# EAGLE design RoverGyro (EAGLE 6.4)
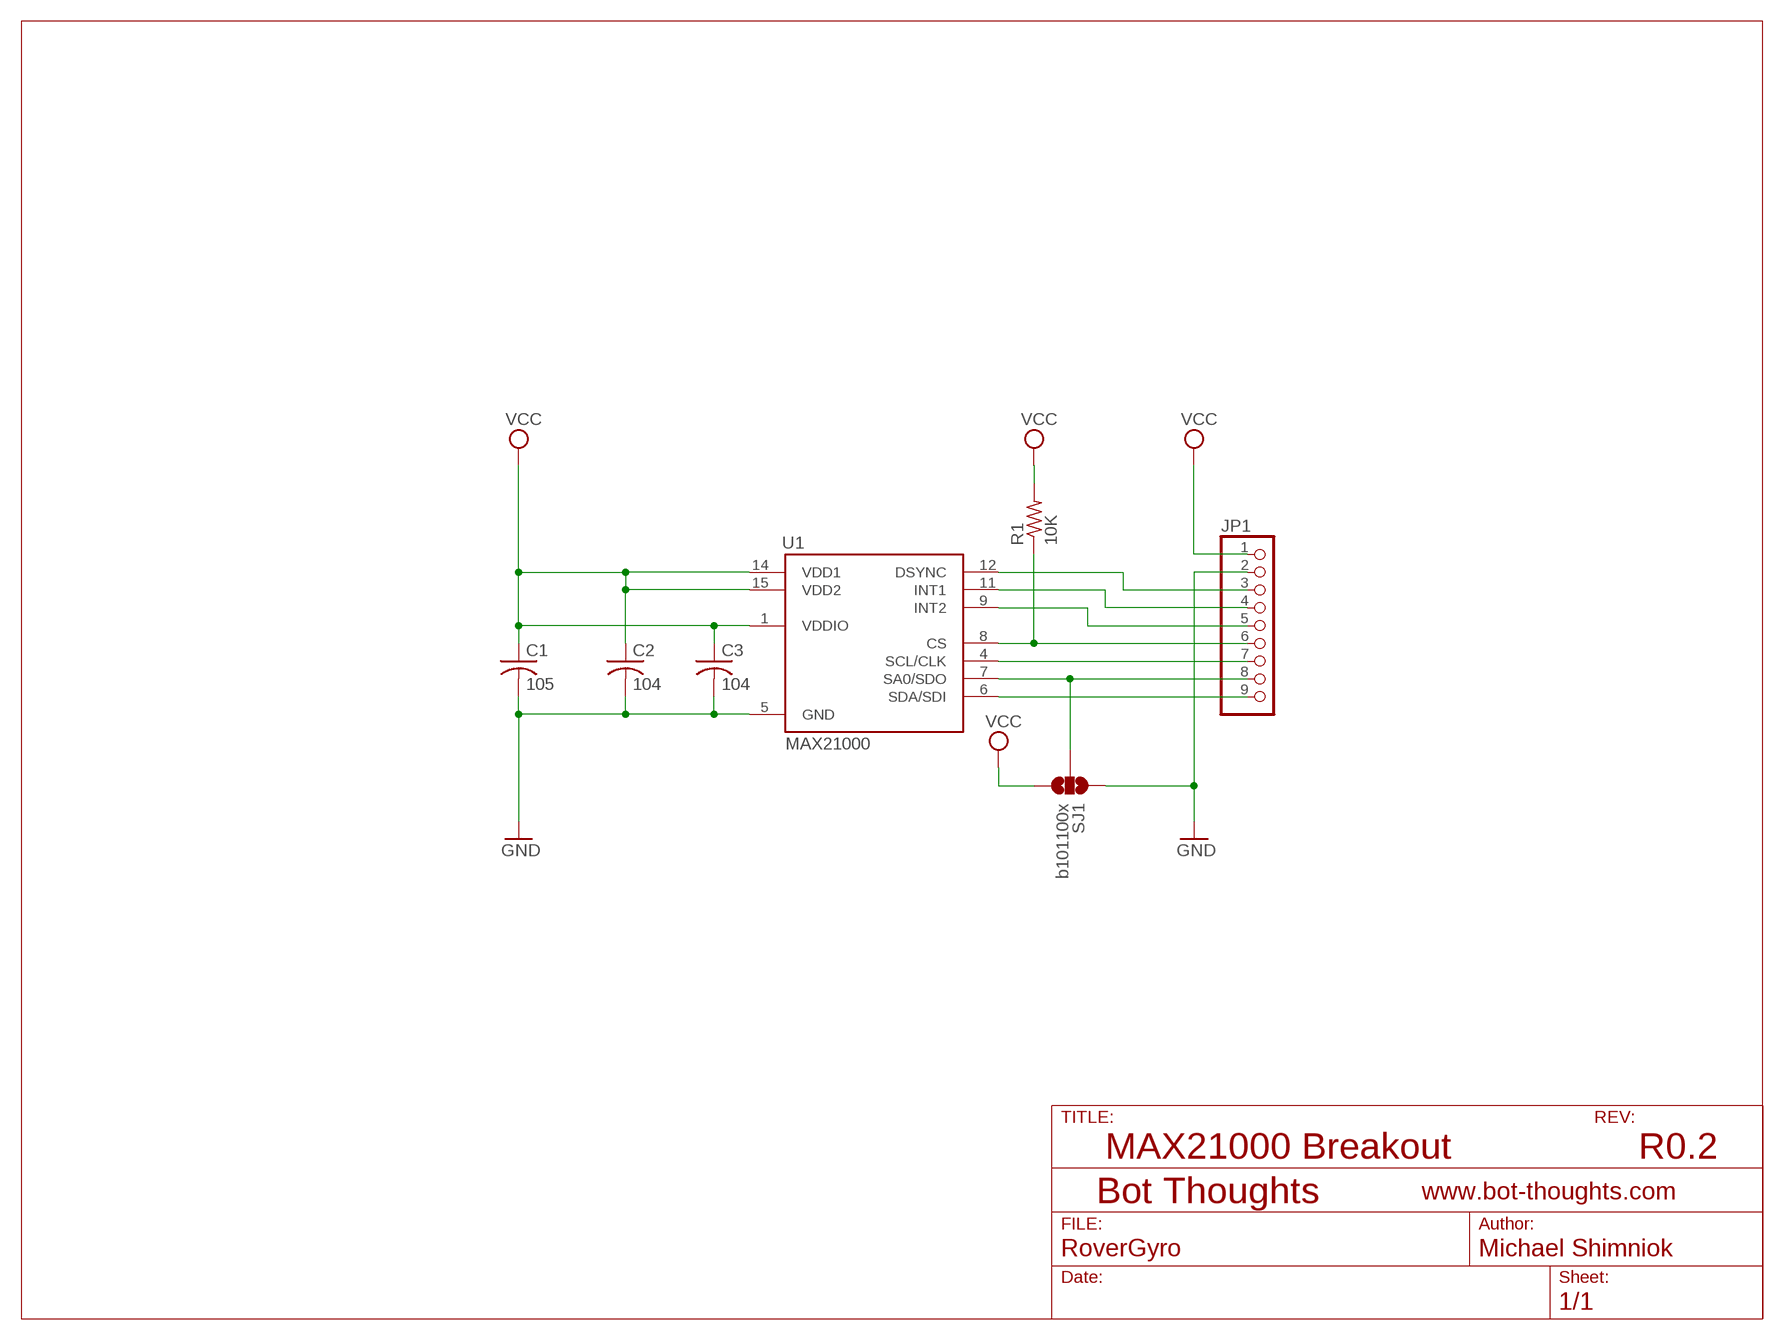
[diagram p0: schematic, sheet 1]

## Parts
C1  105  C-USC0603  [C0603]
C2  104  C-USC0603  [C0603]
C3  104  C-USC0603  [C0603]
JP1  PINHD-1X09_2.54-S  [1X09-S]
R1  10K  R-US_R0603  [R0603]
SJ1  b101100x  SOLDERJUMPER_2WAYS  [SJ_3]
U1  MAX21000  [16LGA]

## Nets
CS: JP1.6 R1.1 U1.8(CS)
DSYNC: JP1.3 U1.12(DSYNC)
GND: C1.2 C2.2 C3.2 JP1.2 SJ1.1 U1.5(GND)
INT1: JP1.4 U1.11(INT1)
INT2: JP1.5 U1.9(INT2)
SA0/SDO: JP1.8 SJ1.2 U1.7(SA0/SDO)
SCL/SCK: JP1.7 U1.4(SCL/CLK)
SDA/SDI: JP1.9 U1.6(SDA/SDI)
VCC: C1.1 C2.1 C3.1 JP1.1 R1.2 SJ1.3 U1.1(VDDIO) U1.14(VDD1) U1.15(VDD2)

## Notes on the sheet
- MAX21000 Breakout | R0.2

## Library data of the parts
C1-C3 = rcl:C-US: CAPACITOR, American symbol
JP1 = pinhead-2:PINHD-1X09: PIN HEADER
R1 = rcl:R-US_: RESISTOR, American symbol
SJ1 = SparkFun-Passives:SOLDERJUMPER_2WAY: Solder Jumper 2 way solder jumper
U1 = bt:MAX21000: MAX21000 MEMS Gyro The MAX21000 is a low power, low noise, 3-axis angular rate sensor that delivers unprecedented accuracy and sensitivity over temperature and time. It operates with a supply voltage as low as 1.71V for minimum power consumption. It includes a sensing element and an IC interface that provides the measured angular rate to the external world through a digital interface (I2C/SPI). Datasheet.pdf <http://datasheets.maximintegrated.com/en/ds/MAX21000.pdf>

## Board
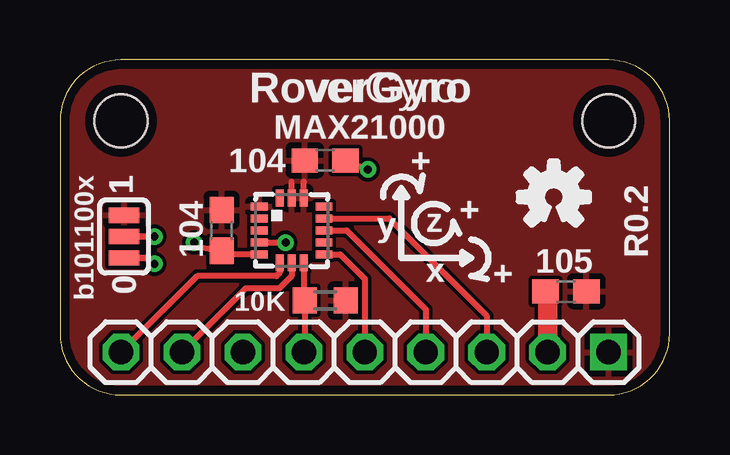
[diagram p1: board, top side]
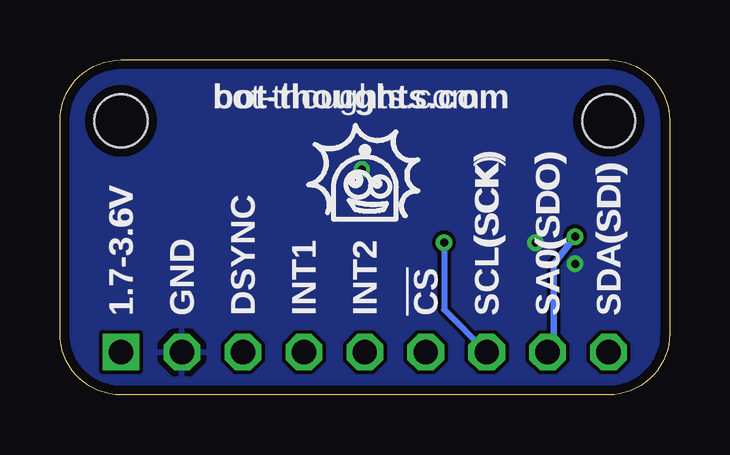
[diagram p2: board, bottom side, seen from below]

Size 25.4 x 13.97 mm. Coordinates in mm from the lower left corner, seen from the top.
Outline: 0,11.43 0,2.54 arc90 2.54,0 22.86,0 arc90 25.4,2.54 25.4,11.43 arc90 22.86,13.97 2.54,13.97 arc90 0,11.43
Copper layers (1*16): Top 0.0356mm / dielectric 1.5011mm / Bottom 0.0356mm
Design rules "LaenPCBOrder": minimum track width 6mil, minimum drill 13mil, track to track 6mil, track to pad 6mil, pad to pad 6mil, via to via 6mil, smd to smd 6mil, copper to edge 15mil, drill to drill 6mil, minimum pad ring 7mil, minimum via ring 7mil, stop-mask expansion 4mil, vias tented up to drill 20mil, thermal gap 10mil
Holes 2.2 mm at 2.54,11.43 22.86,11.43

### Footprints (pad centres in the part's own frame; a part is rotated, then mirrored left to right if it is on the bottom)
C0603 = smd 1.1 x 1: 1 -0.85,0; 2 0.85,0
1X09-S = drill 1.016 square: 1 -10.16,0 | drill 1.016 octagon: 2 -7.62,0; 3 -5.08,0; 4 -2.54,0; 5 0,0; 6 2.54,0; 7 5.08,0; 8 7.62,0; 9 10.16,0
R0603 = smd 1 x 1.1: 1 -0.85,0; 2 0.85,0
SJ_3 = smd 0.635 x 1.27: 1 -0.889,0; 2 0,0; 3 0.889,0
16LGA = smd 0.7 x 0.34: 1 -1.35,1; 2 -1.35,0.5; 3 -1.35,0; 4 -1.35,-0.5; 5 -1.35,-1; 9 1.35,-1; 10 1.35,-0.5; 11 1.35,0; 12 1.35,0.5; 13 1.35,1 | smd 0.34 x 0.7: 6 -0.5,-1.35; 7 0,-1.35; 8 0.5,-1.35; 14 0.5,1.35; 15 0,1.35; 16 -0.5,1.35

### Placement (x,y rotation side)
C1  21.08,4.32 180 top
C2  6.73,6.86 270 top
C3  11.05,9.78 0 top
JP1  12.7,1.78 180 top
R1  11.05,3.94 0 top
SJ1  2.67,6.6 90 top
U1  9.65,6.86 0 top
U$1  [OSHW-LOGO-S]  20.57,8.26 0 top

### Tracks (layer width: path | path; a pad name or v marks a point on that pad's centre or on a via)
CS
  Top 0.254: U1.8 10.15,3.98 R1.1 10.2,1.82 JP1.6
DSYNC
  Top 0.254: U1.12 13.72,7.36 17.78,3.3 JP1.3
GND  (via drill 0.33)
  Top 0.254: C3.2 v12.83,9.4 | U1.5 7.01,5.86 C2.2 5.93,6.13 v5.59,6.35
  Top 0.26: SJ1.1 3.68,5.71 v3.94,5.46
  Top 0.406: 20.32,4.15 C1.2
  Top 0.813: 20.32,4.15 JP1.2
  pour Bottom: 22.86,0 2.54,0 arc-90 0,2.54 0,11.43 arc-90 2.54,13.97 22.86,13.97 arc-90 25.4,11.43 25.4,2.54 arc-90
INT1
  Top 0.254: U1.11 11.94,6.86 15.24,3.56 JP1.4
INT2
  Top 0.254: U1.9 11.67,5.86 12.7,4.83 JP1.5
SA0/SDO  (via drill 0.33)
  Top 0.254: U1.7 9.65,4.95 9.14,4.45 7.75,4.45 JP1.8
  Top 0.26: SJ1.2 v3.94,6.6
  Bottom 0.26: v3.94,6.6 4.83,5.46 4.83,2.03 JP1.8
SCL/SCK  (via drill 0.33)
  Top 0.254: U1.4 v9.39,6.36 v9.4,6.35
  Bottom 0.254: v9.4,6.35 9.4,3.56 JP1.7
SDA/SDI
  Top 0.254: U1.6 9.15,5.09 9.02,4.95 5.71,4.95 JP1.9
VCC
  Top 0.254: U1.15 9.65,8.89 | U1.14 10.15,8.88 10.16,8.89
  pour Top: 22.86,0 2.54,0 arc-90 0,2.54 0,11.43 arc-90 2.54,13.97 22.86,13.97 arc-90 25.4,11.43 25.4,2.54 arc-90

### Text on the board
tPlace: + | y | z | + | x | +
tNames: RoverGyro | 1 | R0.2 | 0
bNames: bot-thoughts.com | SDA(SDI) | SA0(SDO) | SCL(SCK) | !CS | INT2 | INT1 | DSYNC | GND | 1.7-3.6V
tsilk: RoverGyro | MAX21000 | 104 | + | 1 | y | z | + | 104 | R0.2 | x | + | 105 | b101100x | 0 | 10K
bsilk: bot-thoughts.com | SDA(SDI) | SA0(SDO) | SCL(SCK) | !CS | INT2 | INT1 | DSYNC | GND | 1.7-3.6V